# Altium schematic sheet Subsheets combined.SchDoc
size A4; Organization: Altium Limited; Address1: 3 Minna Close; Address2: Belrose; Address3: NSW 2085; Address4: Australia
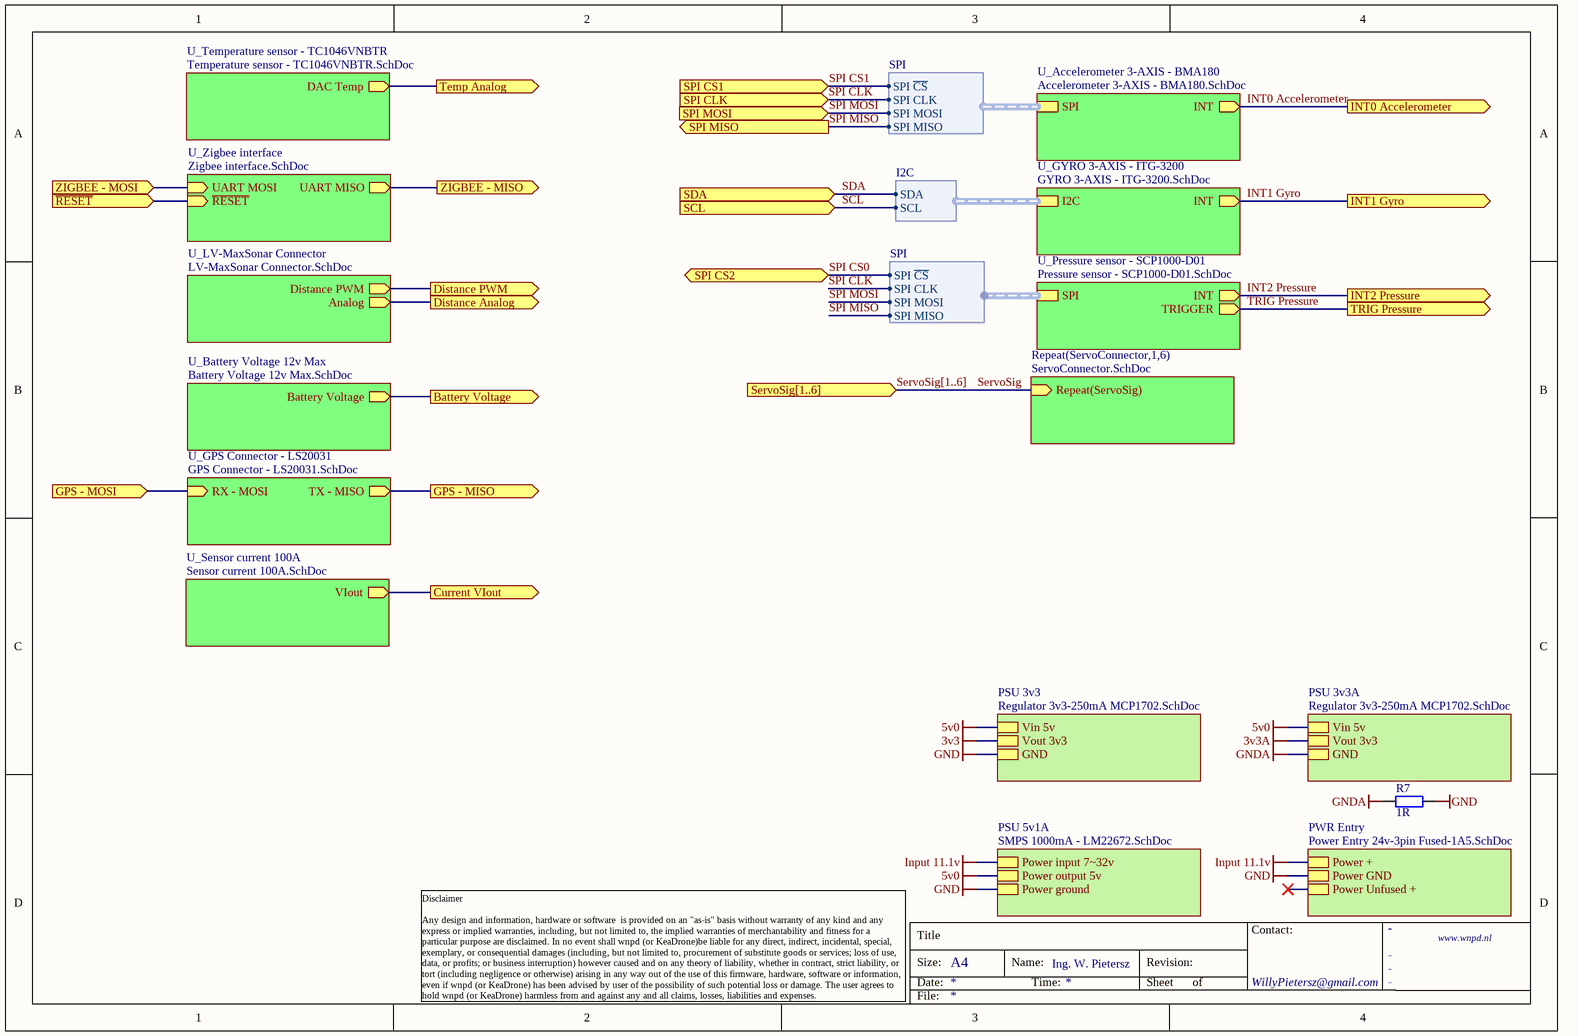
[diagram p0: Subsheets combined.SchDoc]

## Parts
R7  value 1R  [R0805]  (hidden comment: RESISTOR)

## Sub-sheets
PSU 3v3 = Regulator 3v3-250mA MCP1702.SchDoc: Vin 5v, Vout 3v3, GND
PSU 3v3A = Regulator 3v3-250mA MCP1702.SchDoc: Vin 5v, Vout 3v3, GND
PSU 5v1A = SMPS 1000mA - LM22672.SchDoc: Power input 7~32v, Power output 5v, Power ground
PWR Entry = Power Entry 24v-3pin Fused-1A5.SchDoc: Power +, Power GND, Power Unfused +
Repeat(ServoConnector,1,6) = ServoConnector.SchDoc: Repeat(ServoSig) (in)
U_Accelerometer 3-AXIS - BMA180 = Accelerometer 3-AXIS - BMA180.SchDoc: INT (out), SPI (harness SPI)
U_Battery Voltage 12v Max = Battery Voltage 12v Max.SchDoc: Battery Voltage (out)
U_GPS Connector - LS20031 = GPS Connector - LS20031.SchDoc: RX - MOSI (in), TX - MISO (out)
U_GYRO 3-AXIS - ITG-3200 = GYRO 3-AXIS - ITG-3200.SchDoc: INT (out), I2C (harness I2C)
U_LV-MaxSonar Connector = LV-MaxSonar Connector.SchDoc: Distance PWM (out), Analog (out)
U_Pressure sensor - SCP1000-D01 = Pressure sensor - SCP1000-D01.SchDoc: INT (out), TRIGGER (out), SPI (harness SPI)
U_Sensor current 100A = Sensor current 100A.SchDoc: VIout (out)
U_Temperature sensor - TC1046VNBTR = Temperature sensor - TC1046VNBTR.SchDoc: DAC Temp (out)
U_Zigbee interface = Zigbee interface.SchDoc: UART MISO (out), UART MOSI (in), ~{RESET} (in)

## Ports
Battery Voltage (out), Current VIout (out), Distance Analog (out), Distance PWM (out), GPS - MISO (out), GPS - MOSI (in), INT0 Accelerometer (out), INT1 Gyro (out), INT2 Pressure (out), SCL (in), SDA (in), ServoSig[1..6] (in), SPI CLK (in), SPI CS1 (in), SPI CS2 (in), SPI MISO (out), SPI MOSI (in), Temp Analog (out), TRIG Pressure (out), ZIGBEE - MISO (out), ZIGBEE - MOSI (in), ~{RESET} (in)

## Harnesses
SPI: SPI ~{CS}, SPI CLK, SPI MOSI, SPI MISO
I2C: SDA, SCL

## Nets
3v3: sheet PSU 3v3/Vout 3v3
3v3A: sheet PSU 3v3A/Vout 3v3
5v0: sheet PSU 5v1A/Power output 5v, sheet PSU 3v3/Vin 5v, sheet PSU 3v3A/Vin 5v
GND: R7.2 ; sheet PSU 5v1A/Power ground, sheet PSU 3v3/GND, sheet PWR Entry/Power GND
GNDA: R7.1 ; sheet PSU 3v3A/GND
Input 11.1v: sheet PSU 5v1A/Power input 7~32v, sheet PWR Entry/Power +
Battery Voltage: port Battery Voltage, sheet U_Battery Voltage 12v Max/Battery Voltage
Current VIout: port Current VIout, sheet U_Sensor current 100A/VIout
Distance Analog: port Distance Analog, sheet U_LV-MaxSonar Connector/Analog
Distance PWM: port Distance PWM, sheet U_LV-MaxSonar Connector/Distance PWM
GPS - MISO: port GPS - MISO, sheet U_GPS Connector - LS20031/TX - MISO
GPS - MOSI: port GPS - MOSI, sheet U_GPS Connector - LS20031/RX - MOSI
INT0 Accelerometer: port INT0 Accelerometer, sheet U_Accelerometer 3-AXIS - BMA180/INT
INT1 Gyro: port INT1 Gyro, sheet U_GYRO 3-AXIS - ITG-3200/INT
INT2 Pressure: port INT2 Pressure, sheet U_Pressure sensor - SCP1000-D01/INT
~{RESET}: port ~{RESET}, sheet U_Zigbee interface/~{RESET}
SCL: port SCL, sheet U_GYRO 3-AXIS - ITG-3200/I2C.SCL
SDA: port SDA, sheet U_GYRO 3-AXIS - ITG-3200/I2C.SDA
ServoSig: sheet Repeat(ServoConnector,1,6)/Repeat(ServoSig)
SPI CLK: port SPI CLK, sheet U_Accelerometer 3-AXIS - BMA180/SPI.SPI CLK, sheet U_Pressure sensor - SCP1000-D01/SPI.SPI CLK
SPI CS0: sheet U_Pressure sensor - SCP1000-D01/SPI.SPI ~{CS}
SPI CS1: port SPI CS1, sheet U_Accelerometer 3-AXIS - BMA180/SPI.SPI ~{CS}
SPI MISO: port SPI MISO, sheet U_Accelerometer 3-AXIS - BMA180/SPI.SPI MISO, sheet U_Pressure sensor - SCP1000-D01/SPI.SPI MISO
SPI MOSI: port SPI MOSI, sheet U_Accelerometer 3-AXIS - BMA180/SPI.SPI MOSI, sheet U_Pressure sensor - SCP1000-D01/SPI.SPI MOSI
Temp Analog: port Temp Analog, sheet U_Temperature sensor - TC1046VNBTR/DAC Temp
TRIG Pressure: port TRIG Pressure, sheet U_Pressure sensor - SCP1000-D01/TRIGGER
ZIGBEE - MISO: port ZIGBEE - MISO, sheet U_Zigbee interface/UART MISO
ZIGBEE - MOSI: port ZIGBEE - MOSI, sheet U_Zigbee interface/UART MOSI

## Buses and harness runs
bus ServoSig[1..6] = port ServoSig[1..6]

## Notes on the sheet
- Title
- Size:
- Date:
- A4
- Name:
- Time:
- Ing. W. Pietersz
- Revision:
- Sheet
- of
- WillyPietersz@gmail.com
- Contact:
- -
- www.wnpd.nl
- Disclaimer
  Any design and information, hardware or software  is provided on an "as-is" basis without warranty of any kind and any express or implied warranties, including, but not limited to, the implied warranties of merchantability and fitness for a particular purpose are disclaimed. In no event shall wnpd (or KeaDrone)be liable for any direct, indirect, incidental, special, exemplary, or consequential damages (including, but not limited to, procurement of substitute goods or services; loss of use, data, or profits; or business interruption) however caused and on any theory of liability, whether in contract, strict liability, or tort (including negligence or otherwise) arising in any way out of the use of this firmware, hardware, software or information, even if wnpd (or KeaDrone) has been advised by user of the possibility of such potential loss or damage. The user agrees to hold wnpd (or KeaDrone) harmless from and against any and all claims, losses, liabilities and expenses.
- File:

## Library data of the parts
R7 = 1R: Manufacturer 1: Panasonic; Manufacturer 1 Part No: ERJT06J1R0V; Power: 0.25W; Tolerance: 0.05; LatestRevision Note: Initial Release; Published: 8-Jun-2000; LatestRevisionDate: 17-Jul-2002; LatestRevisionNote: Re-released for DXP Platform.; PackageReference: AXIAL-0.4; Publisher: Altium Limited; Part Number: 1R; Type: Film; Package: 0805; Component Type: Standard; LatestRevision Date: 30-7-2010; Author: Willy Pietersz; ROHS: Y; Supplier 2: Farnell; Supplier Part Number 2: 1618236; ComponentLink1Description: Manufacturer; ComponentLink2Description: Datasheet